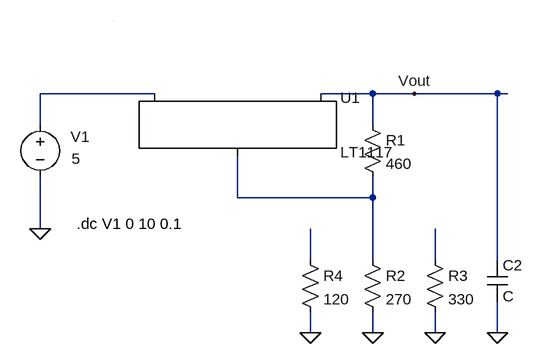
[diagram p0: schematic linear_regulator.asc]
linear_regulator.asc, the LTspice schematic file:
Version 4
SHEET 1 880 680
WIRE 64 112 -112 112
WIRE 400 112 320 112
WIRE 464 112 400 112
WIRE 592 112 464 112
WIRE 608 112 592 112
WIRE -112 160 -112 112
WIRE 400 160 400 112
WIRE 192 272 192 208
WIRE 400 272 400 240
WIRE 400 272 192 272
WIRE -112 320 -112 240
WIRE 304 368 304 320
WIRE 400 368 400 272
WIRE 496 368 496 320
WIRE 592 368 592 112
WIRE 304 480 304 448
WIRE 400 480 400 448
WIRE 496 480 496 448
WIRE 592 480 592 432
WIRE 0 0 0 0
FLAG -112 320 0
FLAG 400 480 0
FLAG 464 112 Vout
FLAG 496 480 0
FLAG 304 480 0
FLAG 592 480 0
SYMBOL PowerProducts\\LT1117 192 112 R0
SYMATTR InstName U1
SYMBOL voltage -112 144 R0
WINDOW 3 48 68 Left 2
WINDOW 123 0 0 Left 0
WINDOW 39 0 0 Left 0
WINDOW 0 47 34 Left 2
SYMATTR Value 5
SYMATTR InstName V1
SYMBOL res 384 144 R0
SYMATTR InstName R1
SYMATTR Value 460
SYMBOL res 384 352 R0
SYMATTR InstName R2
SYMATTR Value 270
SYMBOL res 480 352 R0
SYMATTR InstName R3
SYMATTR Value 330
SYMBOL res 288 352 R0
SYMATTR InstName R4
SYMATTR Value 120
SYMBOL cap 576 368 R0
SYMATTR InstName C2
TEXT -56 312 Left 2 !.dc V1 0 10 0.1

The netlist it stands for:
* linear_regulator.asc
XU1 N002 Vout N001 LT1117
V1 N001 0 5
R1 Vout N002 460
R2 N002 0 270
R3 N004 0 330
R4 N003 0 120
C2 Vout 0 C
.dc V1 0 10 0.1
.lib LT1117.lib
.backanno
.end